# Altium schematic sheet feedback.SchDoc: foxBMS BMS-Slave 12-Cell
size A3; DocumentNumber: 8; SheetNumber: 8; SheetTotal: 19; AUTHOR: Fraunhofer IISB foxBMS Team; SheetDescription: Passive Balancing Feedback
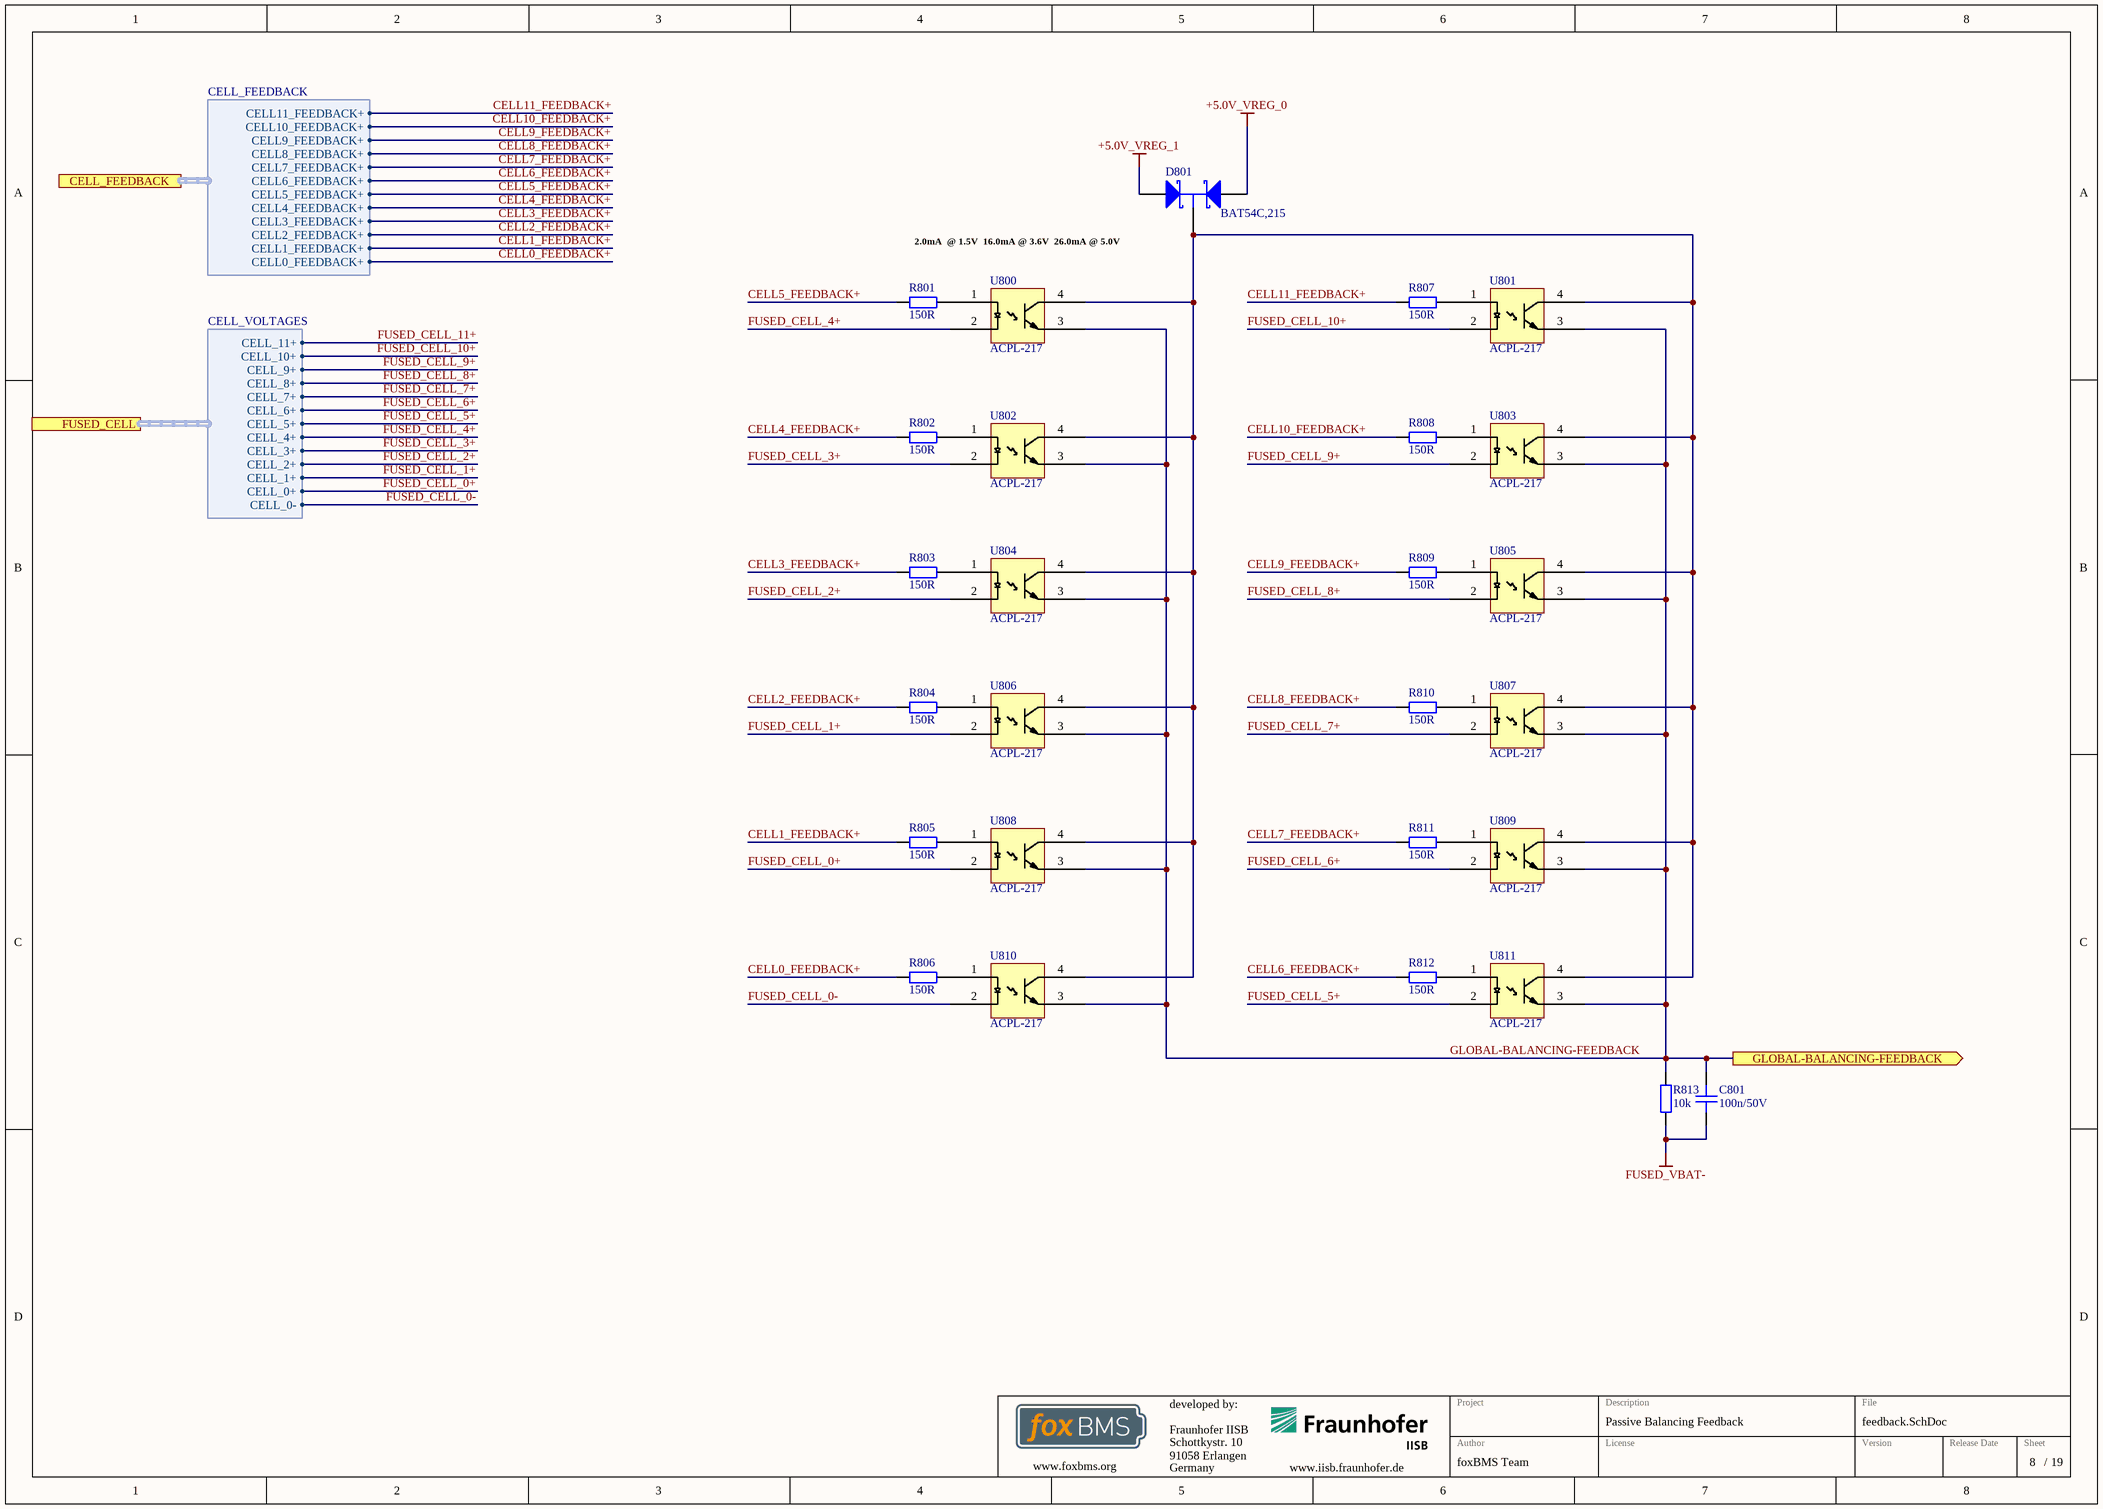
[diagram p0: feedback.SchDoc]

## Parts
C801  100n/50V  [CAPC1608X08N]
D801  BAT54C,215  [NXP-SOT23-3_V]
R801  150R  [RESC1608X05N]
R802  150R  [RESC1608X05N]
R803  150R  [RESC1608X05N]
R804  150R  [RESC1608X05N]
R805  150R  [RESC1608X05N]
R806  150R  [RESC1608X05N]
R807  150R  [RESC1608X05N]
R808  150R  [RESC1608X05N]
R809  150R  [RESC1608X05N]
R810  150R  [RESC1608X05N]
R811  150R  [RESC1608X05N]
R812  150R  [RESC1608X05N]
R813  10k  [RESC1608X05N]
U800  ACPL-217  [SOIC127P700X220-4N]
U801  ACPL-217  [SOIC127P700X220-4N]
U802  ACPL-217  [SOIC127P700X220-4N]
U803  ACPL-217  [SOIC127P700X220-4N]
U804  ACPL-217  [SOIC127P700X220-4N]
U805  ACPL-217  [SOIC127P700X220-4N]
U806  ACPL-217  [SOIC127P700X220-4N]
U807  ACPL-217  [SOIC127P700X220-4N]
U808  ACPL-217  [SOIC127P700X220-4N]
U809  ACPL-217  [SOIC127P700X220-4N]
U810  ACPL-217  [SOIC127P700X220-4N]
U811  ACPL-217  [SOIC127P700X220-4N]

## Ports
CELL_FEEDBACK (harness CELL_FEEDBACK), FUSED_CELL (harness CELL_VOLTAGES), GLOBAL-BALANCING-FEEDBACK (out)

## Harnesses
CELL_FEEDBACK: CELL11_FEEDBACK+, CELL10_FEEDBACK+, CELL9_FEEDBACK+, CELL8_FEEDBACK+, CELL7_FEEDBACK+, CELL6_FEEDBACK+, CELL5_FEEDBACK+, CELL4_FEEDBACK+, CELL3_FEEDBACK+, CELL2_FEEDBACK+, CELL1_FEEDBACK+, CELL0_FEEDBACK+
CELL_VOLTAGES: CELL_0-, CELL_0+, CELL_1+, CELL_10+, CELL_11+, CELL_2+, CELL_3+, CELL_4+, CELL_5+, CELL_6+, CELL_7+, CELL_8+, CELL_9+

## Nets
+5.0V_VREG_0: D801.2(A)
+5.0V_VREG_1: D801.1(A)
FUSED_VBAT-: C801.1 R813.2
CELL0_FEEDBACK+: R806.1 ; port CELL_FEEDBACK.CELL0_FEEDBACK+
CELL1_FEEDBACK+: R805.1 ; port CELL_FEEDBACK.CELL1_FEEDBACK+
CELL2_FEEDBACK+: R804.1 ; port CELL_FEEDBACK.CELL2_FEEDBACK+
CELL3_FEEDBACK+: R803.1 ; port CELL_FEEDBACK.CELL3_FEEDBACK+
CELL4_FEEDBACK+: R802.1 ; port CELL_FEEDBACK.CELL4_FEEDBACK+
CELL5_FEEDBACK+: R801.1 ; port CELL_FEEDBACK.CELL5_FEEDBACK+
CELL6_FEEDBACK+: R812.1 ; port CELL_FEEDBACK.CELL6_FEEDBACK+
CELL7_FEEDBACK+: R811.1 ; port CELL_FEEDBACK.CELL7_FEEDBACK+
CELL8_FEEDBACK+: R810.1 ; port CELL_FEEDBACK.CELL8_FEEDBACK+
CELL9_FEEDBACK+: R809.1 ; port CELL_FEEDBACK.CELL9_FEEDBACK+
CELL10_FEEDBACK+: R808.1 ; port CELL_FEEDBACK.CELL10_FEEDBACK+
CELL11_FEEDBACK+: R807.1 ; port CELL_FEEDBACK.CELL11_FEEDBACK+
FUSED_CELL_0+: U808.2 ; port FUSED_CELL.CELL_0+
FUSED_CELL_0-: U810.2 ; port FUSED_CELL.CELL_0-
FUSED_CELL_1+: U806.2 ; port FUSED_CELL.CELL_1+
FUSED_CELL_2+: U804.2 ; port FUSED_CELL.CELL_2+
FUSED_CELL_3+: U802.2 ; port FUSED_CELL.CELL_3+
FUSED_CELL_4+: U800.2 ; port FUSED_CELL.CELL_4+
FUSED_CELL_5+: U811.2 ; port FUSED_CELL.CELL_5+
FUSED_CELL_6+: U809.2 ; port FUSED_CELL.CELL_6+
FUSED_CELL_7+: U807.2 ; port FUSED_CELL.CELL_7+
FUSED_CELL_8+: U805.2 ; port FUSED_CELL.CELL_8+
FUSED_CELL_9+: U803.2 ; port FUSED_CELL.CELL_9+
FUSED_CELL_10+: U801.2 ; port FUSED_CELL.CELL_10+
FUSED_CELL_11+: port FUSED_CELL.CELL_11+
GLOBAL-BALANCING-FEEDBACK: C801.2 R813.1 U800.3 U801.3 U802.3 U803.3 U804.3 U805.3 U806.3 U807.3 U808.3 U809.3 U810.3 U811.3 ; port GLOBAL-BALANCING-FEEDBACK
NetD801_3: D801.3(K) U800.4 U801.4 U802.4 U803.4 U804.4 U805.4 U806.4 U807.4 U808.4 U809.4 U810.4 U811.4
NetR801_2: R801.2 U800.1
NetR802_2: R802.2 U802.1
NetR803_2: R803.2 U804.1
NetR804_2: R804.2 U806.1
NetR805_2: R805.2 U808.1
NetR806_2: R806.2 U810.1
NetR807_2: R807.2 U801.1
NetR808_2: R808.2 U803.1
NetR809_2: R809.2 U805.1
NetR810_2: R810.2 U807.1
NetR811_2: R811.2 U809.1
NetR812_2: R812.2 U811.1

## Notes on the sheet
- 2.0mA  @ 1.5V
  16.0mA @ 3.6V
  26.0mA @ 5.0V
- Fraunhofer IISB
- Schottkystr. 10
- developed by:
- 91058 Erlangen
- Germany
- Author
- Project
- License
- Description
- File
- Version
- Release Date
- Sheet
- www.foxbms.org
- www.iisb.fraunhofer.de
- foxBMS Team
- /

## Library data of the parts
C801 = gen_C_ceramic_100n_50V_X7R_0603: MLCC; Capacitance: 100n; Rated Voltage: 50V; Dielectric: X7R; Case EIA: 0603; Case Metric: 1608; PnP Package: C_0603_10; PnP Value: 100n/50V/X7R; PnP equipped: x; Automotive Qualified: False; Part Number: gen_C_ceramic_100n_50V_X7R_0603; Supplier 1: Farnell; Supplier Part Number 1: 2525267; Supplier 2: Digikey; Supplier Part Number 2: 490-6049-1-ND
D801 = CMP-2000-04915-1: Schottky Barrier Diode, 30 V, 3-Pin SOT23, RoHS, Tape and Reel; Manufacturer: NXP Semiconductors; Forward Surge Current Ifsm Max: 600mA; Pin Configuration: 1A1,2A2,3comK; Package Version: Feb-16; Forward Voltage VF Max: 800mV; SMD Marking: L43/*W1; Diode Case Style: SOT-23; Reverse Recovery Time trr Typ: 5ns; Forward Current If(AV): 200mA; Reel Quantity: 3000; SVHC: NoSVHC(19-Dec-2012); No. of Pins: 3; Junction Temperature Tj Max: 125degC; Common Connection: Cathode; Repetitive Reverse Voltage Vrrm Max: 30V; Operating Temperature Max: 150degC; Operating Temperature Range: -65degCto+150degC; Termination Type: SMD; Package Description: 3-Pin Small Outline Transistor, Body 1.3 x 2.9 mm, Pitch 0.95 mm; Package / Case: SOT-23; Diode Type: Schottky; Manufacturer URL: http://www.nxp.com/; Tape Width: 8mm; Package Reference: SOT23-3; Datasheet URL: https://datasheet.ciiva.com/33723/1668625-33723936.pdf; Datasheet Version: Rev. 5 , 10/2012; Operating Temperature Min: -65degC; Current Ifsm: 600mA; Reverse Recovery Time trr Max: 5ns; Package URL: http://www.nxp.com/documents/outline_drawing/SOT23.pdf; Forward Voltage: 800mV
R801-R812 = gen_R_150R_0603: SMD Resistor 150R 0603; Tolerance: 1%; Power: 0.1W; Case EIA: 0603; Case Metric: 1608; Maximum Working Voltage: 75V; PnP Package: R_0603; Automotive Qualified: False; Part Number: gen_R_150R_0603; Operating Temperature: -55°C - +155°C; Resistance: 150R; Series: E24, E96; PnP Value: 150R; Supplier 1: Farnell; Supplier Part Number 1: 1469760
R813 = gen_R_10k_0603: SMD Resistor 10k 0603; Tolerance: 1%; Power: 0.1W; Case EIA: 0603; Case Metric: 1608; Maximum Working Voltage: 75V; PnP Package: R_0603; Automotive Qualified: False; Part Number: gen_R_10k_0603; Operating Temperature: -55°C - +155°C; Resistance: 10k; Series: E24, E96; PnP Value: 10k; Supplier 1: Farnell; Supplier Part Number 1: 2073349
U800-U811 = ACPL-217-56BE: Optocoupler, Transistor Output, 1 Channel; Manufacturer: Broadcom Limited; Automotive Qualified: False; Part Number: ACPL-217-56BE; Part Name: ACPL-217; Operating Temperature: -55°C - +110°C; ComponentLink1Description: Datenblatt; ComponentLink1URL: http://www.farnell.com/datasheets/45634.pdf; Supplier 1: Farnell; Supplier Part Number 1: 1602623